# EAGLE design speakerboard (EAGLE 8.0.1)
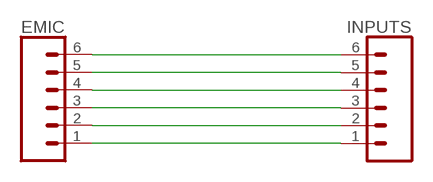
[diagram p0: schematic, sheet 1]

## Parts
EMIC  CONN_06SILK_FEMALE_PTH  [1X06]
INPUTS  CONN_06SILK_FEMALE_PTH  [1X06]

## Nets
N$1: EMIC.6 INPUTS.6
N$2: EMIC.5 INPUTS.5
N$3: EMIC.4 INPUTS.4
N$4: EMIC.3 INPUTS.3
N$5: EMIC.2 INPUTS.2
N$6: EMIC.1 INPUTS.1

## Library data of the parts
EMIC INPUTS = SparkFun-Connectors:CONN_06: Multi connection point. Often used as Generic Header-pin footprint for 0.1 inch spaced/style header connections On any of the 0.1 inch spaced packages, you can populate with these: Break Away Headers - Straight <https://www.sparkfun.com/products/116> (PRT-00116) Break Away Male Headers - Right Angle <https://www.sparkfun.com/products/553> (PRT-00553) Female Headers <https://www.sparkfun.com/products/115> (PRT-00115) Break Away Headers - Machine Pin <https://www.sparkfun.com/products/117> (PRT-00117) Break Away Female Headers - Swiss Machine Pin <https://www.sparkfun.com/products/743> (PRT-00743) Arduino Stackable Header - 6 Pin <https://www.sparkfun.com/products/9280> (PRT-09280) For SCREWTERMINALS and SPRING TERMINALS visit here: Screw Terimnals on SparkFun.com <https://www.sparkfun.com/search/results?term=Screw+Terminals> (5mm/3.5mm/2.54mm spacing) This device is also useful as a general connection point to wire up your design to another part of your project. Our various solder wires solder well into these plated through hole pads. Hook-Up Wire - Assortment (Stranded, 22 AWG) <https://www.sparkfun.com/products/11375> (PRT-11375) Hook-Up Wire - Assortment (Solid Core, 22 AWG) <https://www.sparkfun.com/products/11367> (PRT-11367) View the entire wire category on our website here <https://www.sparkfun.com/categories/141>; PROD_ID: CONN-08437

## Board
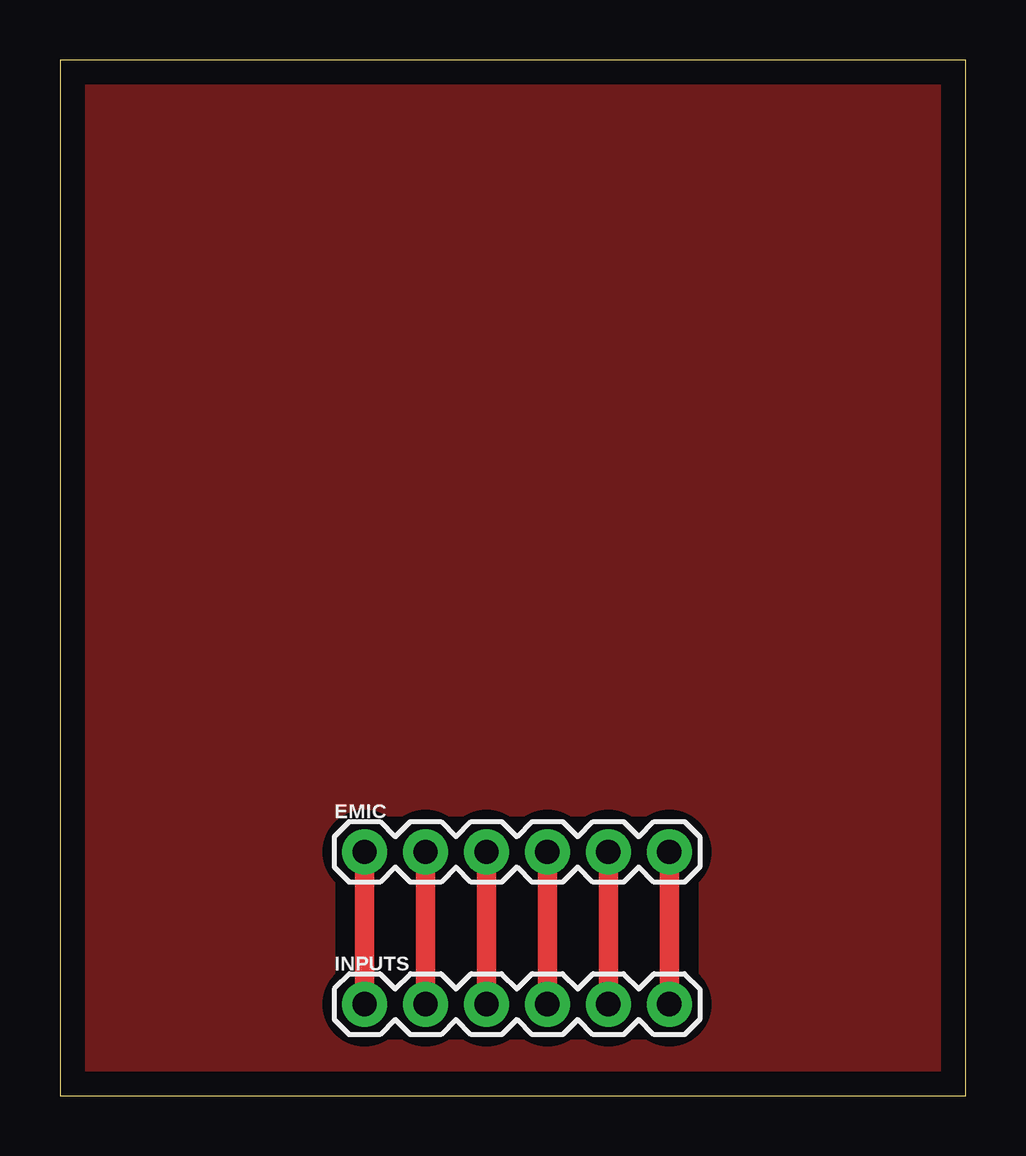
[diagram p1: board, top side]

Size 37.77 x 43.17 mm. Coordinates in mm from the lower left corner, seen from the top.
Outline: 0,0 37.77,0 37.77,43.17 0,43.17 0,0
Copper layers (1*16): Top 0.035mm / dielectric 1.5mm / Bottom 0.035mm
Design rules "default": minimum track width 10mil, minimum drill 24mil, track to track 8mil, track to pad 8mil, pad to pad 8mil, via to via 8mil, smd to smd 8mil, copper to edge 40mil, drill to drill 8mil, minimum pad ring 10mil, minimum via ring 8mil, stop-mask expansion 4mil, vias tented up to drill 0mil, thermal gap 10mil

### Footprints (pad centres in the part's own frame; a part is rotated, then mirrored left to right if it is on the bottom)
1X06 = drill 1.016 pad 1.88: 1 0,0; 2 2.54,0; 3 5.08,0; 4 7.62,0; 5 10.16,0; 6 12.7,0

### Placement (x,y rotation side)
EMIC  12.7,10.16 0 top
INPUTS  12.7,3.81 0 top

### Tracks (layer width: path | path; a pad name or v marks a point on that pad's centre or on a via)
N$1
  Top 0.813: EMIC.6 INPUTS.6
N$2
  Top 0.813: EMIC.5 INPUTS.5
N$3
  Top 0.813: EMIC.4 INPUTS.4
N$4
  Top 0.813: EMIC.3 INPUTS.3
N$5
  Top 0.813: EMIC.2 INPUTS.2
N$6
  Top 0.813: EMIC.1 INPUTS.1
N$7
  pour Top (isolate 0.813): 38.1,43.18 0,43.18 0,0 38.1,0

### Text on the board
tRestrict: EE149: ASLGLove